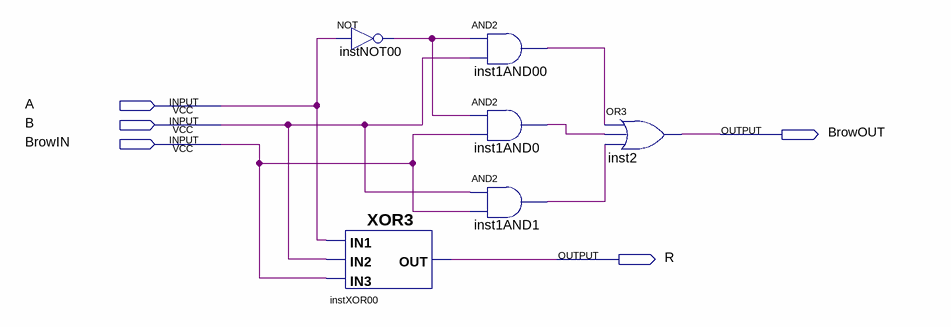
[diagram p0: schematic sheet]
// Quartus schematic Sub1BIT.bdf as structural Verilog: 6 symbols, 5 pins
module Sub1BIT (
  input  A,
  input  B,
  input  BrowIN,
  output BrowOUT,
  output R
);

  wire inst1AND00_out, inst1AND0_out, inst1AND1_out, instNOT00_out;

  not instNOT00 (instNOT00_out, A);
  XOR3 instXOR00 (.IN3(BrowIN), .IN1(A), .IN2(B), .OUT(R));
  and inst1AND00 (inst1AND00_out, instNOT00_out, B);
  and inst1AND0 (inst1AND0_out, instNOT00_out, BrowIN);
  and inst1AND1 (inst1AND1_out, B, BrowIN);
  or inst2 (BrowOUT, inst1AND00_out, inst1AND0_out, inst1AND1_out);
endmodule
